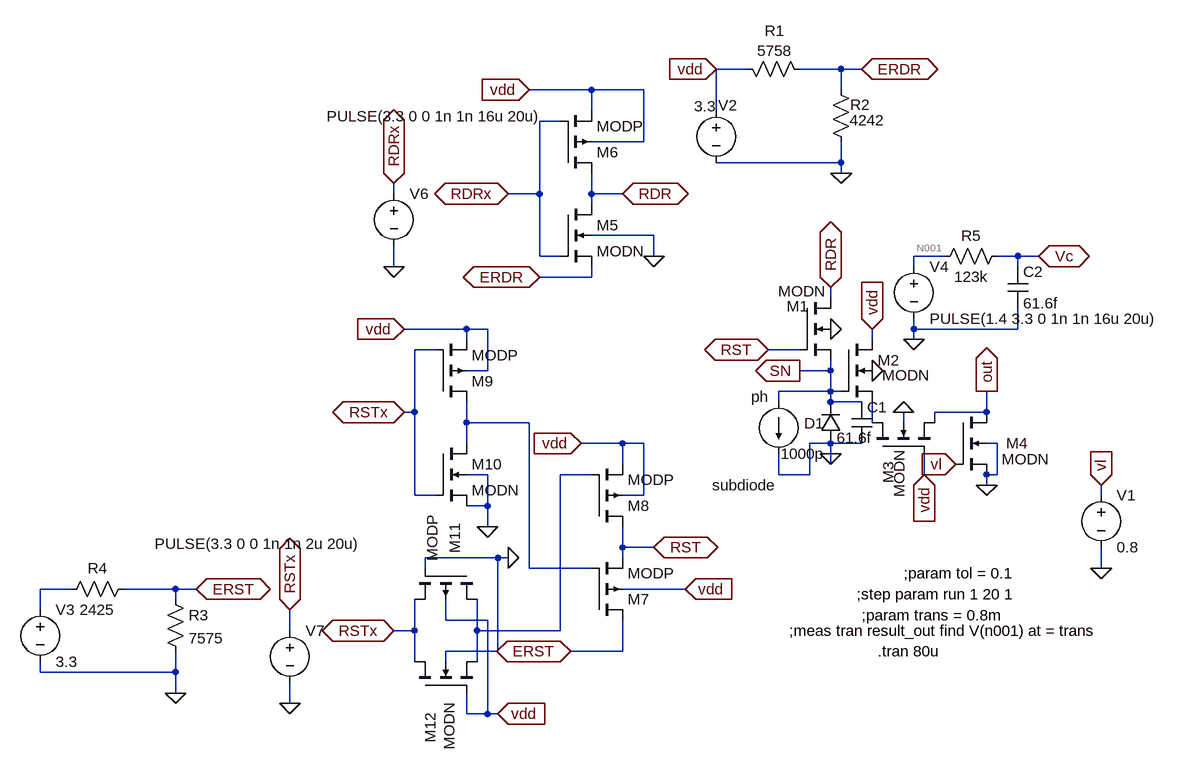
[diagram p0: schematic LIN LOG 2014 completo2 rdr mod.asc]
LIN LOG 2014 completo2 rdr mod.asc, the LTspice schematic file:
Version 4
SHEET 1 1672 840
WIRE 384 -4864 336 -4864
WIRE 528 -4864 464 -4864
WIRE 560 -4864 528 -4864
WIRE 144 -4832 48 -4832
WIRE 224 -4832 144 -4832
WIRE 528 -4832 528 -4864
WIRE 144 -4800 144 -4832
WIRE 336 -4800 336 -4864
WIRE 96 -4784 64 -4784
WIRE 224 -4752 224 -4832
WIRE 224 -4752 144 -4752
WIRE 528 -4720 528 -4752
WIRE 528 -4720 336 -4720
WIRE 528 -4704 528 -4720
WIRE -160 -4672 -160 -4688
WIRE 64 -4672 64 -4784
WIRE 64 -4672 16 -4672
WIRE 144 -4672 144 -4704
WIRE 192 -4672 144 -4672
WIRE 144 -4656 144 -4672
WIRE 240 -4608 144 -4608
WIRE 64 -4576 64 -4672
WIRE 96 -4576 64 -4576
WIRE 240 -4576 240 -4608
WIRE 688 -4576 640 -4576
WIRE 800 -4576 768 -4576
WIRE 832 -4576 800 -4576
WIRE -160 -4560 -160 -4592
WIRE 640 -4560 640 -4576
WIRE 800 -4560 800 -4576
WIRE 144 -4544 144 -4560
WIRE 144 -4544 64 -4544
WIRE 512 -4512 512 -4528
WIRE -48 -4464 -144 -4464
WIRE -16 -4464 -48 -4464
WIRE 640 -4464 640 -4480
WIRE 800 -4464 800 -4496
WIRE 800 -4464 640 -4464
WIRE -48 -4448 -48 -4464
WIRE 576 -4448 576 -4464
WIRE 640 -4448 640 -4464
WIRE -96 -4432 -128 -4432
WIRE 464 -4432 416 -4432
WIRE -16 -4400 -16 -4464
WIRE -16 -4400 -48 -4400
WIRE 512 -4400 512 -4416
WIRE 512 -4400 464 -4400
WIRE 512 -4368 512 -4400
WIRE 512 -4368 432 -4368
WIRE 528 -4368 512 -4368
WIRE 432 -4352 432 -4368
WIRE 512 -4352 512 -4368
WIRE 560 -4352 512 -4352
WIRE -128 -4336 -128 -4432
WIRE -128 -4336 -144 -4336
WIRE 752 -4336 752 -4368
WIRE 752 -4336 672 -4336
WIRE -48 -4320 -48 -4352
WIRE 48 -4320 -48 -4320
WIRE 576 -4320 576 -4352
WIRE 624 -4320 624 -4336
WIRE 672 -4320 672 -4336
WIRE -48 -4288 -48 -4320
WIRE 192 -4288 128 -4288
WIRE 224 -4288 192 -4288
WIRE 512 -4288 480 -4288
WIRE 560 -4288 512 -4288
WIRE 768 -4288 752 -4288
WIRE 512 -4272 512 -4288
WIRE 192 -4256 192 -4288
WIRE 512 -4256 512 -4272
WIRE -16 -4240 -48 -4240
WIRE 144 -4240 96 -4240
WIRE 432 -4240 432 -4272
WIRE 480 -4240 480 -4288
WIRE 480 -4240 432 -4240
WIRE 656 -4240 656 -4272
WIRE 752 -4240 752 -4256
WIRE 768 -4240 768 -4288
WIRE 768 -4240 752 -4240
WIRE 752 -4224 752 -4240
WIRE -128 -4208 -128 -4336
WIRE -96 -4208 -128 -4208
WIRE 224 -4208 224 -4288
WIRE 224 -4208 192 -4208
WIRE 928 -4208 928 -4224
WIRE -16 -4192 -16 -4240
WIRE -16 -4192 -48 -4192
WIRE -16 -4160 -16 -4192
WIRE 192 -4128 192 -4160
WIRE 240 -4128 192 -4128
WIRE 0 -4112 -112 -4112
WIRE 16 -4112 0 -4112
WIRE 192 -4112 192 -4128
WIRE -112 -4096 -112 -4112
WIRE 48 -4096 48 -4320
WIRE 144 -4096 48 -4096
WIRE 928 -4096 928 -4128
WIRE -656 -4064 -704 -4064
WIRE -496 -4064 -576 -4064
WIRE -464 -4064 -496 -4064
WIRE 288 -4064 192 -4064
WIRE -496 -4048 -496 -4064
WIRE -704 -4032 -704 -4064
WIRE -80 -4016 -80 -4048
WIRE -16 -4016 -80 -4016
WIRE -320 -4000 -320 -4032
WIRE -128 -4000 -128 -4048
WIRE -128 -4000 -160 -4000
WIRE -32 -4000 -32 -4048
WIRE 96 -4000 96 -4240
WIRE 96 -4000 -32 -4000
WIRE 0 -3968 0 -4112
WIRE 0 -3968 -80 -3968
WIRE 192 -3968 192 -4016
WIRE 192 -3968 112 -3968
WIRE -128 -3952 -128 -4000
WIRE -80 -3952 -80 -3968
WIRE -32 -3952 -32 -4000
WIRE -704 -3936 -704 -3952
WIRE -496 -3936 -496 -3968
WIRE -496 -3936 -704 -3936
WIRE -496 -3904 -496 -3936
WIRE -320 -3888 -320 -3920
WIRE -48 -3872 -48 -3904
WIRE -16 -3872 -16 -4016
WIRE -16 -3872 -48 -3872
WIRE 0 -3872 -16 -3872
FLAG 416 -4432 RST
IOPIN 416 -4432 BiDir
FLAG 928 -4096 0
FLAG 528 -4704 0
FLAG 512 -4464 0
FLAG 512 -4272 0
FLAG 512 -4528 RDR
IOPIN 512 -4528 BiDir
FLAG 336 -4864 vdd
IOPIN 336 -4864 In
FLAG 576 -4400 0
FLAG 752 -4224 0
FLAG 704 -4256 vl
IOPIN 704 -4256 In
FLAG 928 -4224 vl
IOPIN 928 -4224 In
FLAG 576 -4464 vdd
IOPIN 576 -4464 In
FLAG 624 -4336 0
FLAG 656 -4240 vdd
IOPIN 656 -4240 In
FLAG 752 -4368 out
IOPIN 752 -4368 Out
FLAG 464 -4400 SN
IOPIN 464 -4400 Out
FLAG 560 -4864 ERDR
IOPIN 560 -4864 BiDir
FLAG 48 -4832 vdd
IOPIN 48 -4832 In
FLAG 240 -4576 0
FLAG 192 -4672 RDR
IOPIN 192 -4672 BiDir
FLAG 16 -4672 RDRx
IOPIN 16 -4672 BiDir
FLAG 64 -4544 ERDR
IOPIN 64 -4544 BiDir
FLAG -160 -4560 0
FLAG -160 -4688 RDRx
IOPIN -160 -4688 BiDir
FLAG 128 -4288 vdd
IOPIN 128 -4288 In
FLAG 240 -4128 RST
IOPIN 240 -4128 BiDir
FLAG 288 -4064 vdd
IOPIN 288 -4064 In
FLAG 112 -3968 ERST
IOPIN 112 -3968 BiDir
FLAG -144 -4464 vdd
IOPIN -144 -4464 In
FLAG -144 -4336 RSTx
IOPIN -144 -4336 BiDir
FLAG -16 -4160 0
FLAG 0 -3872 vdd
IOPIN 0 -3872 In
FLAG 16 -4112 0
FLAG -160 -4000 RSTx
IOPIN -160 -4000 BiDir
FLAG -320 -4032 RSTx
IOPIN -320 -4032 BiDir
FLAG -320 -3888 0
FLAG -496 -3904 0
FLAG -464 -4064 ERST
IOPIN -464 -4064 BiDir
FLAG 832 -4576 Vc
IOPIN 832 -4576 BiDir
FLAG 640 -4448 0
SYMBOL voltage 928 -4224 R0
WINDOW 123 0 0 Left 2
WINDOW 39 0 0 Left 2
SYMATTR InstName V1
SYMATTR Value 0.8
SYMBOL voltage 336 -4816 R0
WINDOW 123 0 0 Left 2
WINDOW 39 0 0 Left 2
WINDOW 0 3 8 Left 2
WINDOW 3 -34 9 Left 2
SYMATTR InstName V2
SYMATTR Value 3.3
SYMBOL nmos4 464 -4512 R0
WINDOW 0 -20 13 Left 2
WINDOW 3 -33 -10 Left 2
SYMATTR InstName M1
SYMATTR Value MODN
SYMATTR Value2 l=0.35u w=0.70u
SYMBOL nmos4 528 -4448 R0
WINDOW 3 63 55 Left 2
SYMATTR Value MODN
SYMATTR InstName M2
SYMATTR Value2 l=0.35u w=0.70u
SYMBOL nmos4 704 -4336 R0
WINDOW 0 78 48 Left 2
WINDOW 3 71 72 Left 2
SYMATTR InstName M4
SYMATTR Value MODN
SYMATTR Value2 l=0.35u w=0.70u
SYMBOL diode 528 -4288 R180
WINDOW 0 26 31 Left 2
WINDOW 3 100 -64 Left 2
SYMATTR InstName D1
SYMATTR Value subdiode
SYMBOL current 432 -4352 R0
WINDOW 3 3 80 Left 2
WINDOW 123 0 0 Left 2
WINDOW 39 0 0 Left 2
WINDOW 0 -42 -8 Left 2
SYMATTR Value 1000p
SYMATTR InstName ph
SYMBOL nmos4 576 -4272 R270
WINDOW 0 -46 25 Left 2
WINDOW 3 -67 42 Left 2
SYMATTR InstName M3
SYMATTR Value MODN
SYMATTR Value2 l=0.35u w=0.70u
SYMBOL res 368 -4880 M90
WINDOW 0 -27 58 VBottom 2
WINDOW 3 -28 58 VTop 2
SYMATTR InstName R1
SYMATTR Value 5758
SYMBOL res 544 -4736 R180
WINDOW 0 -29 73 Left 2
WINDOW 3 -51 49 Left 2
SYMATTR InstName R2
SYMATTR Value 4242
SYMBOL nmos4 96 -4656 R0
SYMATTR InstName M5
SYMATTR Value MODN
SYMATTR Value2 l=0.35u w=0.70u
SYMBOL pmos4 96 -4704 M180
SYMATTR InstName M6
SYMATTR Value MODP
SYMATTR Value2 l=0.35u w=0.70u
SYMBOL voltage -160 -4688 R0
WINDOW 3 -103 -103 Left 2
WINDOW 123 0 0 Left 2
WINDOW 39 0 0 Left 2
SYMATTR Value PULSE(3.3 0 0 1n 1n 16u 20u)
SYMATTR InstName V6
SYMBOL pmos4 144 -4016 M180
SYMATTR InstName M7
SYMATTR Value MODP
SYMATTR Value2 l=0.35u w=0.70u
SYMBOL pmos4 144 -4160 M180
SYMATTR InstName M8
SYMATTR Value MODP
SYMATTR Value2 l=0.35u w=0.70u
SYMBOL pmos4 -96 -4352 M180
SYMATTR InstName M9
SYMATTR Value MODP
SYMATTR Value2 l=0.35u w=0.70u
SYMBOL nmos4 -96 -4288 R0
SYMATTR InstName M10
SYMATTR Value MODN
SYMATTR Value2 l=0.35u w=0.70u
SYMBOL pmos4 -32 -4096 R90
WINDOW 0 -70 34 Left 2
WINDOW 3 -82 69 Left 2
SYMATTR InstName M11
SYMATTR Value MODP
SYMATTR Value2 l=0.35u w=0.70u
SYMBOL nmos4 -128 -3904 R270
WINDOW 0 -77 24 Left 2
WINDOW 3 -88 53 Left 2
SYMATTR InstName M12
SYMATTR Value MODN
SYMATTR Value2 l=0.35u w=0.70u
SYMBOL voltage -320 -4016 R0
WINDOW 3 -208 -118 Left 2
WINDOW 123 0 0 Left 2
WINDOW 39 0 0 Left 2
SYMATTR Value PULSE(3.3 0 0 1n 1n 2u 20u)
SYMATTR InstName V7
SYMBOL res -512 -4064 R0
SYMATTR InstName R3
SYMATTR Value 7575
SYMBOL res -560 -4080 R90
WINDOW 0 0 56 VBottom 2
WINDOW 3 32 56 VTop 2
SYMATTR InstName R4
SYMATTR Value 2425
SYMBOL voltage -704 -4048 R0
SYMATTR InstName V3
SYMATTR Value 3.3
SYMBOL cap 544 -4352 R0
WINDOW 3 -23 55 Left 2
SYMATTR Value 61.6f
SYMATTR InstName C1
SYMBOL res 784 -4592 R90
WINDOW 0 0 56 VBottom 2
WINDOW 3 32 56 VTop 2
SYMATTR InstName R5
SYMATTR Value 123k
SYMBOL cap 784 -4560 R0
SYMATTR InstName C2
SYMATTR Value 61.6f
SYMBOL voltage 640 -4576 R0
WINDOW 123 0 0 Left 2
WINDOW 39 0 0 Left 2
SYMATTR InstName V4
SYMATTR Value PULSE(1.4 3.3 0 1n 1n 16u 20u)
TEXT 584 -3968 Left 2 !.tran 80u
TEXT 624 -4088 Left 2 !;param tol = 0.1
TEXT 552 -4056 Left 2 !;step param run 1 20 1
TEXT 560 -4024 Left 2 !;param trans = 0.8m
TEXT 448 -4000 Left 2 !;meas tran result_out find V(n001) at = trans

The netlist it stands for:
* LIN LOG 2014 completo2 rdr mod.asc
V1 vl 0 0.8
V2 vdd 0 3.3
M1 RDR RST SN 0 MODN l=0.35u w=0.70u
M2 vdd SN N003 0 MODN l=0.35u w=0.70u
M4 out vl 0 0 MODN l=0.35u w=0.70u
D1 0 SN subdiode
I§ph SN 0 1000p
M3 N003 vdd out 0 MODN l=0.35u w=0.70u
R1 vdd ERDR 5758
R2 0 ERDR 4242
M5 RDR RDRx ERDR 0 MODN l=0.35u w=0.70u
M6 RDR RDRx vdd vdd MODP l=0.35u w=0.70u
V6 RDRx 0 PULSE(3.3 0 0 1n 1n 16u 20u)
M7 ERST N002 RST vdd MODP l=0.35u w=0.70u
M8 RST N004 vdd vdd MODP l=0.35u w=0.70u
M9 N002 RSTx vdd vdd MODP l=0.35u w=0.70u
M10 N002 RSTx 0 0 MODN l=0.35u w=0.70u
M11 N004 0 RSTx vdd MODP l=0.35u w=0.70u
M12 RSTx vdd N004 0 MODN l=0.35u w=0.70u
V7 RSTx 0 PULSE(3.3 0 0 1n 1n 2u 20u)
R3 ERST 0 7575
R4 ERST N005 2425
V3 N005 0 3.3
C1 SN 0 61.6f
R5 Vc N001 123k
C2 Vc 0 61.6f
V4 N001 0 PULSE(1.4 3.3 0 1n 1n 16u 20u)
.model D D
.lib standard.dio
.model NMOS NMOS
.model PMOS PMOS
.lib standard.mos
.tran 80u
;param tol = 0.1
;step param run 1 20 1
;param trans = 0.8m
;meas tran result_out find V(n001) at = trans
.backanno
.end